# EAGLE schematic Roll TAPE (EAGLE 9.6.2)
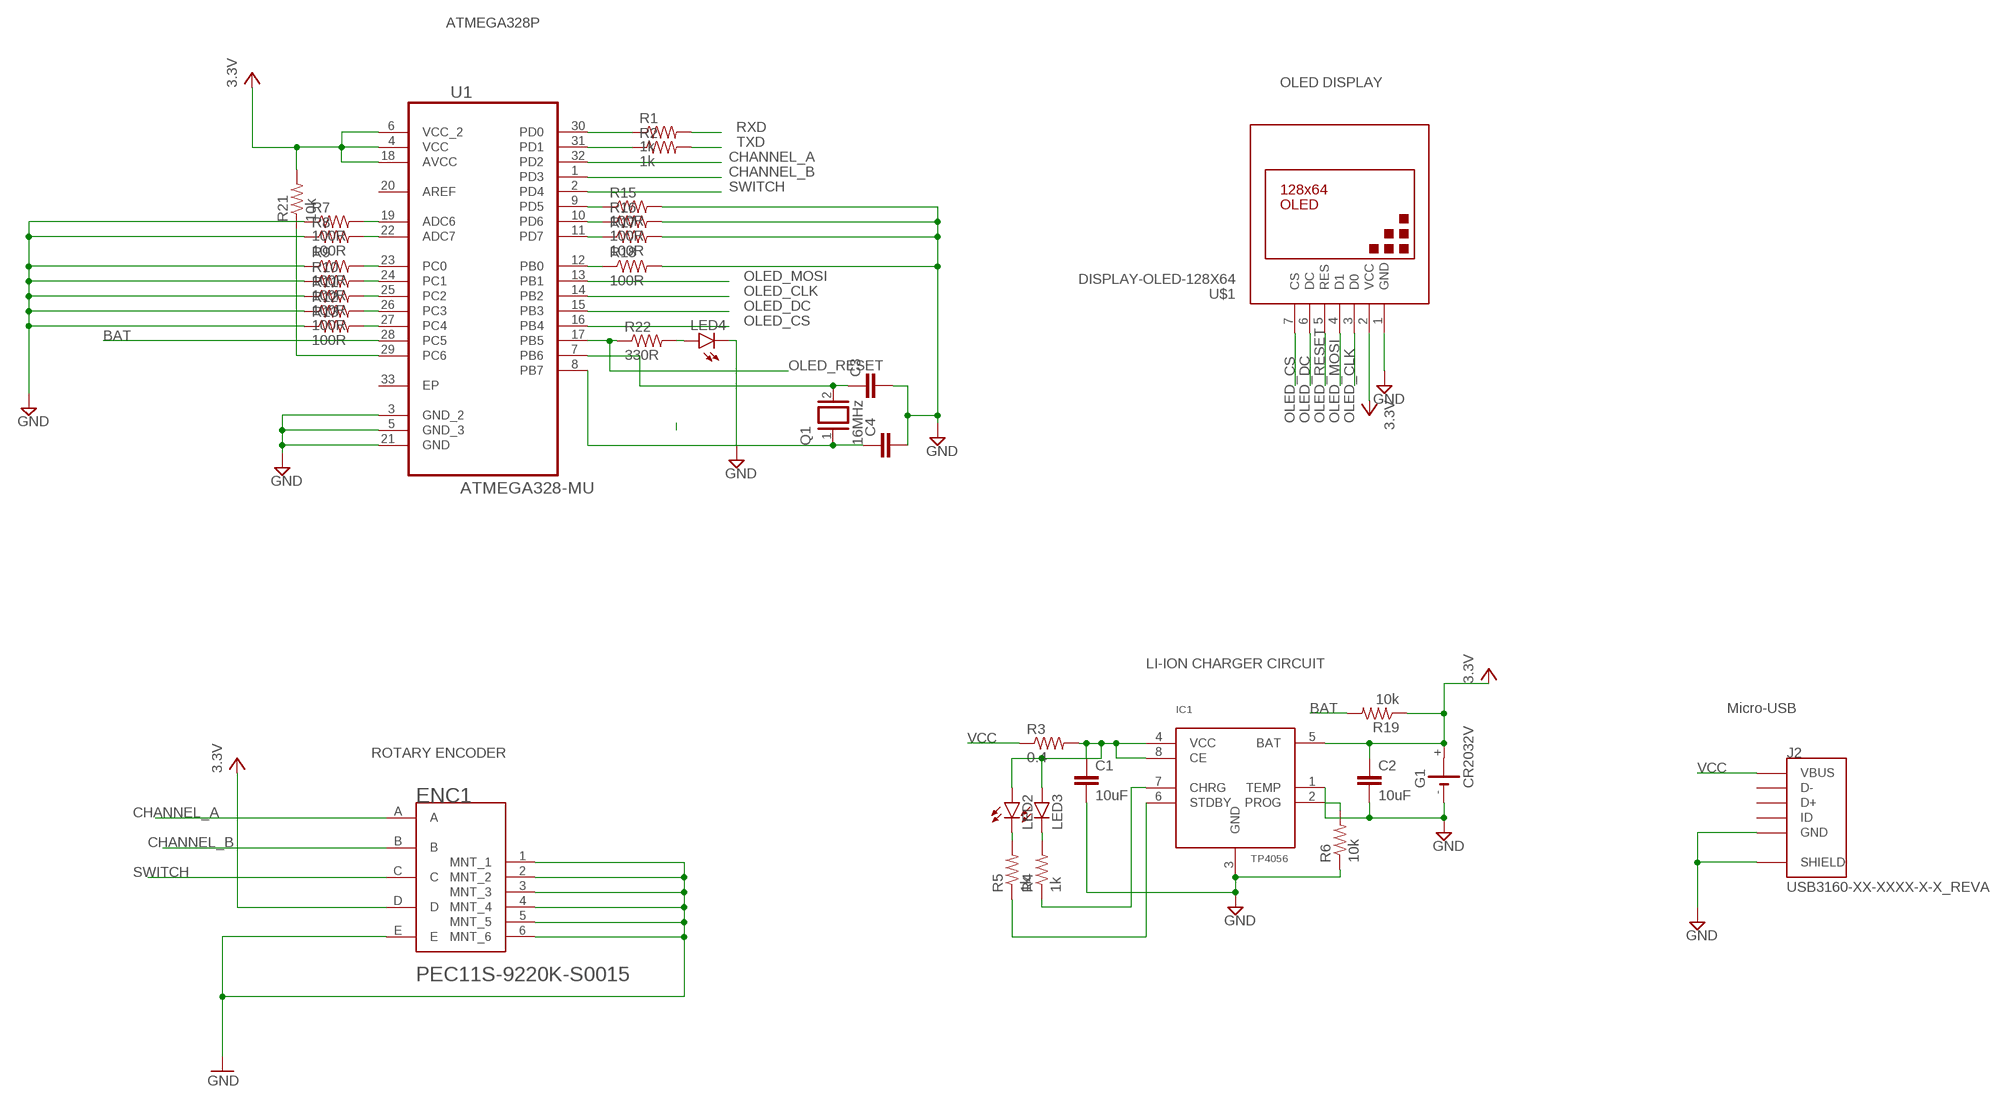
[diagram p0: schematic, sheet 1]

## Parts
C1  10uF  C2,5-3  [C2.5-3]
C2  10uF  C2,5-3  [C2.5-3]
C3  C-EU025-024X044  [C025-024X044]
C4  C-EU025-024X044  [C025-024X044]
ENC1  BOURNS_PEC11S-9220K-S0015BOURNS_PEC11S-9220K-S0015_0_0  [BOURNS_PEC11S-9220K-S0015_0]
G1  CR2032V  [CR2032V]
IC1  TP4056  [SOP-8]
J2  USB3160-XX-XXXX-X-X_REVA  [GCT_USB3160-XX-XXXX-X-X_REVA]
LED2  LEDCHIP-LED0805  [CHIP-LED0805]
LED3  LEDCHIP-LED0805  [CHIP-LED0805]
LED4  LEDCHIP-LED0805  [CHIP-LED0805]
Q1  16MHz  XTAL/S  [QS]
R1  1k  R-US_R0402  [R0402]
R2  1k  R-US_R0402  [R0402]
R3  0.4  R-US_R0402  [R0402]
R4  1k  R-US_R0402  [R0402]
R5  1k  R-US_R0402  [R0402]
R6  10k  R-US_R0402  [R0402]
R7  100R  R-US_R0402  [R0402]
R8  100R  R-US_R0402  [R0402]
R9  100R  R-US_R0402  [R0402]
R10  100R  R-US_R0402  [R0402]
R11  100R  R-US_R0402  [R0402]
R12  100R  R-US_R0402  [R0402]
R13  100R  R-US_R0402  [R0402]
R15  100R  R-US_R0402  [R0402]
R16  100R  R-US_R0402  [R0402]
R17  100R  R-US_R0402  [R0402]
R18  100R  R-US_R0402  [R0402]
R19  10k  R-US_R0402  [R0402]
R21  10k  R-US_R0402  [R0402]
R22  330R  R-US_R0402  [R0402]
U1  ATMEGA328-MU  [QFN50P500X500X100-33N]
U$1  DISPLAY-OLED-128X64  [DISPLAY-OLED-128X64]

## Nets
BAT: R19.2 U1.28(PC5)
CHANNEL_A: ENC1.A U1.32(PD2)
CHANNEL_B: ENC1.B U1.1(PD3)
GND: C1.2 C2.2 C3.2 C4.2 ENC1.1(MNT_1) ENC1.2(MNT_2) ENC1.3(MNT_3) ENC1.4(MNT_4) ENC1.5(MNT_5) ENC1.6(MNT_6) ENC1.E G1.- IC1.1(TEMP) IC1.3(GND) J2.5(GND) J2.6(SHIELD) J2.7(SHIELD) J2.8(SHIELD) R6.1 R7.1 R8.1 R9.1 R10.1 R11.1 R12.1 R13.1 R15.2 R16.2 R17.2 R18.2 U1.3(GND_2) U1.5(GND_3) U1.21(GND) U$1.1(GND)
N$1: R7.2 U1.19(ADC6)
N$2: R1.1 U1.30(PD0)
N$3: R2.1 U1.31(PD1)
N$4: C1.1 IC1.4(VCC) IC1.8(CE) LED2.A LED3.A R3.2
N$5: IC1.6(STDBY) R5.1
N$6: IC1.2(PROG) R6.2
N$7: R8.2 U1.22(ADC7)
N$8: R9.2 U1.23(PC0)
N$9: LED2.C R5.2
N$10: LED3.C R4.2
N$11: IC1.7(CHRG) R4.1
N$12: R10.2 U1.24(PC1)
N$13: R11.2 U1.25(PC2)
N$14: R12.2 U1.26(PC3)
N$15: R13.2 U1.27(PC4)
N$17: R15.1 U1.9(PD5)
N$18: R16.1 U1.10(PD6)
N$19: R17.1 U1.11(PD7)
N$20: R18.1 U1.12(PB0)
N$23: LED4.A R22.2
N$25: R21.1 U1.29(PC6)
N$27: C3.1 Q1.2 U1.7(PB6)
N$28: C4.1 Q1.1 U1.8(PB7)
OLED_CLK: U1.14(PB2) U$1.3(D0)
OLED_CS: U1.16(PB4) U$1.7(CS)
OLED_DC: U1.15(PB3) U$1.6(DC)
OLED_MOSI: U1.13(PB1) U$1.4(D1)
OLED_RESET: LED4.C R22.1 U1.17(PB5) U$1.5(RES) ; supply symbol labelled GND
RXD: R1.2
SWITCH: ENC1.C U1.2(PD4)
TXD: R2.2
VCC: C2.1 ENC1.D G1.+ IC1.5(BAT) J2.1(VBUS) R3.1 R19.1 R21.2 U1.4(VCC) U1.6(VCC_2) U1.18(AVCC) U$1.2(VCC) ; supply symbol labelled 3.3V
Unconnected: G1.+@1(+) J2.2(D-) J2.3(D+) J2.4(ID) U1.20(AREF) U1.33(EP)

## Notes on the sheet
- ATMEGA328P
- OLED DISPLAY
- LI-ION CHARGER CIRCUIT
- Micro-USB
- ROTARY ENCODER

## Library data of the parts
C1 C2 = capacitor-wima:C: CAPACITOR naming: grid - package width
C3 C4 = rcl:C-EU: CAPACITOR, European symbol; SPICEPREFIX: C
ENC1 = Bourns - PEC11S-9220K-S0015:BOURNS_PEC11S-9220K-S0015: Encoders 20 MM SHAFT W/SWITCH 2 DET; CENTROID_NOT_SPECIFIED: No; CONN_ORIENTATION: Vertical; CURRENT_RATING: 10mA; DATASHEET: https://www.bourns.com/docs/Product-Datasheets/PEC11S.pdf; DETEND: Yes; DEVICE_CLASS_L1: Electromechanical; DEVICE_CLASS_L2: Switches; DEVICE_CLASS_L3: Encoders; DIGIKEY_DESCRIPTION: ENC ROTARY ENCODER MECHANICAL 15PPR; DIGIKEY_PART_NUMBER: PEC11S-9220K-S0015-ND; ENCODER_TYPE: Mechanical; HEIGHT: 25.3mm; LEAD_FREE: yes; MF: Bourns; MFG_PACKAGE_IDENT: PEC11S; MFG_PACKAGE_IDENT_DATE: 0; MFG_PACKAGE_IDENT_REV: 0; MOUSER_DESCRIPTION: Mechanical Encoder Rotary Incremental Knurl 1.36oz.in Straight Quadrature Digital Square Wave 15PPR Surface Mount...; MOUSER_PART_NUMBER: 652-PEC11S9220KS0015; MPN: PEC11S-9220K-S0015; PACKAGE: SMT_ENC_11MM7_14MM2; PREFIX: ENC; PULSES_PER_REV: 15; ROHS: yes; TEMPERATURE_RANGE_HIGH: +70°C; TEMPERATURE_RANGE_LOW: -40°C; VERIFICATION_VERSION: 0.0.0.1; VOLTAGE_RATING_DC: 5V
G1 = battery:CR2032V: LI BATTERY Varta
IC1 = TP4056:TP4056; AVAILABILITY: Unavailable; DESCRIPTION: Complete single cell Li-Ion battery with a constant current / constant voltage linear charger; MF: NanJing Top Power ASIC Corp.; MP: TP4056; PACKAGE: Package; PRICE: None
J2 = USB3160-XX-XXXX-X-X_REVA:USB3160-XX-XXXX-X-X_REVA: Micro USB Receptacle, Type B, SMT, Vertical, with Locating Peg, with Through-Hole Shell Stakes Check prices <https://pricing.snapeda.com/parts/USB3160-30-0120-0-C/Global%20Connector%20Technology/view-part?ref=eda>; AVAILABILITY: Warning; DESCRIPTION: USB - micro B USB 2.0 Receptacle Connector 5 Position Surface Mount, Through Hole; MF: Global Connector Technology; MP: USB3160-30-0120-0-C; PACKAGE: None; PRICE: None; PURCHASE-URL: https://pricing.snapeda.com/search/part/USB3160-30-0120-0-C/?ref=eda
LED2-LED4 = led:LED: LED OSRAM: - CHIPLED LG R971, LG N971, LY N971, LG Q971, LY Q971, LO R971, LY R971 LH N974, LH R974 LS Q976, LO Q976, LY Q976 LO Q996 - Hyper CHIPLED LW Q18S LB Q993, LB Q99A, LB R99A - SideLED LS A670, LO A670, LY A670, LG A670, LP A670 LB A673, LV A673, LT A673, LW A673 LH A674 LY A675 LS A676, LA A676, LO A676, LY A676, LW A676 LS A679, LY A679, LG A679 - Hyper Micro SIDELED® LS Y876, LA Y876, LO Y876, LY Y876 LT Y87S - SmartLED LW L88C, LW L88S LB L89C, LB L89S, LG L890 LS L89K, LO L89K, LY L89K LS L896, LA L896, LO L896, LY L896 - TOPLED LS T670, LO T670, LY T670, LG T670, LP T670 LSG T670, LSP T670, LSY T670, LOP T670, LYG T670 LG T671, LOG T671, LSG T671 LB T673, LV T673, LT T673, LW T673 LH T674 LS T676, LA T676, LO T676, LY T676, LB T676, LH T676, LSB T676, LW T676 LB T67C, LV T67C, LT T67C, LS T67K, LO T67K, LY T67K, LW E67C LS E67B, LA E67B, LO E67B, LY E67B, LB E67C, LV E67C, LT E67C LW T67C LS T679, LY T679, LG T679 LS T770, LO T770, LY T770, LG T770, LP T770 LB T773, LV T773, LT T773, LW T773 LH T774 LS E675, LA E675, LY E675, LS T675 LS T776, LA T776, LO T776, LY T776, LB T776 LHGB T686 LT T68C, LB T68C - Hyper Mini TOPLED® LB M676 - Mini TOPLED Santana® LG M470 LS M47K, LO M47K, LY M47K Source: http://www.osram.convergy.de LUXEON: - LUMILED® LXK2-PW12-R00, LXK2-PW12-S00, LXK2-PW14-U00, LXK2-PW14-V00 LXK2-PM12-R00, LXK2-PM12-S00, LXK2-PM14-U00 LXK2-PE12-Q00, LXK2-PE12-R00, LXK2-PE12-S00, LXK2-PE14-T00, LXK2-PE14-U00 LXK2-PB12-K00, LXK2-PB12-L00, LXK2-PB12-M00, LXK2-PB14-N00, LXK2-PB14-P00, LXK2-PB14-Q00 LXK2-PR12-L00, LXK2-PR12-M00, LXK2-PR14-Q00, LXK2-PR14-R00 LXK2-PD12-Q00, LXK2-PD12-R00, LXK2-PD12-S00 LXK2-PH12-R00, LXK2-PH12-S00 LXK2-PL12-P00, LXK2-PL12-Q00, LXK2-PL12-R00 Source: www.luxeon.com KINGBRIGHT: KA-3528ASYC Source: www.kingbright.com
Q1 = special:XTAL/S: CRYSTAL
R1-R13 R15-R19 R21 R22 = rcl:R-US_: RESISTOR, American symbol; SPICEPREFIX: R
U1 = ATMEGA328-MU:ATMEGA328-MU: Programmable Flash Check prices <https://pricing.snapeda.com/parts/ATMEGA328-MU/Microchip%20Technology/view-part?ref=eda>; AVAILABILITY: Good; DESCRIPTION: AVR AVR® ATmega Microcontroller IC 8-Bit 20MHz 32KB (16K x 16) FLASH 32-VQFN (5x5); MF: Microchip Technology; MP: ATMEGA328-MU; PACKAGE: VQFN-32 Microchip Technology; PRICE: None; PURCHASE-URL: https://pricing.snapeda.com/search/part/ATMEGA328-MU/?ref=eda
U$1 = 128x64 OLED:DISPLAY-OLED-128X64: 128x64 Dot Matrix OLED Module based on SSD1306 chip Variant with SPI interface More details available here: http://www.instructables.com/id/How-to-use-OLED-display-arduino-module/ SSD1306 datasheet: https://cdn-shop.adafruit.com/datasheets/SSD1306.pdf Click here to find device on ebay.com <http://www.ebay.com/sch/oled+display+128x64> Note: There are two variants: I2C and SPI. Search for the proper version.